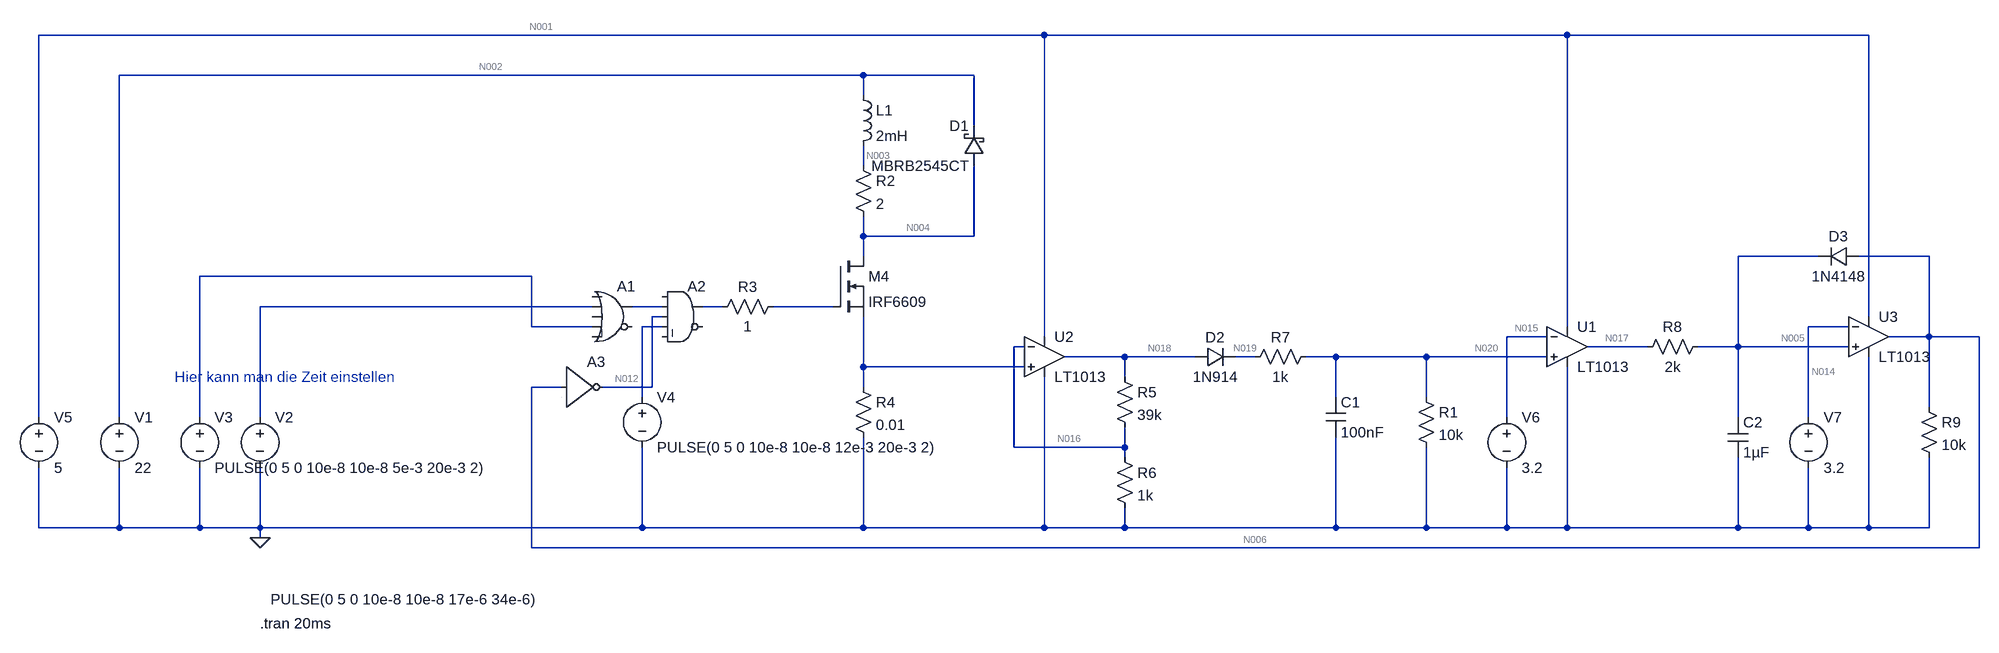
[diagram p0: schematic OpenDrainDriverCurrProtect.asc]
OpenDrainDriverCurrProtect.asc, the LTspice schematic file:
Version 4
SHEET 1 2692 680
WIRE 1200 -464 -400 -464
WIRE 2032 -464 1200 -464
WIRE 2512 -464 2032 -464
WIRE 912 -400 -272 -400
WIRE 1088 -400 912 -400
WIRE 912 -368 912 -400
WIRE 1088 -320 1088 -400
WIRE 912 -256 912 -288
WIRE 912 -144 912 -176
WIRE 1088 -144 1088 -256
WIRE 1088 -144 912 -144
WIRE 912 -112 912 -144
WIRE 2432 -112 2304 -112
WIRE 2608 -112 2496 -112
WIRE 384 -80 -144 -80
WIRE 480 -32 -48 -32
WIRE 592 -32 544 -32
WIRE 688 -32 656 -32
WIRE 864 -32 768 -32
WIRE 592 -16 576 -16
WIRE 2512 -16 2512 -464
WIRE 384 0 384 -80
WIRE 480 0 384 0
WIRE 592 0 560 0
WIRE 2032 0 2032 -464
WIRE 2480 0 2416 0
WIRE 1200 16 1200 -464
WIRE 2000 16 1936 16
WIRE 2608 16 2608 -112
WIRE 2608 16 2544 16
WIRE 2688 16 2608 16
WIRE 1168 32 1152 32
WIRE 2160 32 2064 32
WIRE 2304 32 2304 -112
WIRE 2304 32 2240 32
WIRE 2480 32 2304 32
WIRE 1328 48 1232 48
WIRE 1440 48 1328 48
WIRE 1536 48 1504 48
WIRE 1664 48 1616 48
WIRE 1808 48 1664 48
WIRE 2000 48 1808 48
WIRE 912 64 912 -16
WIRE 1168 64 912 64
WIRE 1328 80 1328 48
WIRE 432 96 384 96
WIRE 576 96 576 -16
WIRE 576 96 496 96
WIRE 912 96 912 64
WIRE 560 112 560 0
WIRE 1664 112 1664 48
WIRE 1808 112 1808 48
WIRE 2608 128 2608 16
WIRE -400 144 -400 -464
WIRE -272 144 -272 -400
WIRE -144 144 -144 -80
WIRE -48 144 -48 -32
WIRE 1936 144 1936 16
WIRE 2304 144 2304 32
WIRE 2416 144 2416 0
WIRE 1152 192 1152 32
WIRE 1328 192 1328 160
WIRE 1328 192 1152 192
WIRE 1328 208 1328 192
WIRE -400 320 -400 224
WIRE -272 320 -272 224
WIRE -272 320 -400 320
WIRE -144 320 -144 224
WIRE -144 320 -272 320
WIRE -48 320 -48 224
WIRE -48 320 -144 320
WIRE 560 320 560 192
WIRE 560 320 -48 320
WIRE 912 320 912 176
WIRE 912 320 560 320
WIRE 1200 320 1200 80
WIRE 1200 320 912 320
WIRE 1328 320 1328 288
WIRE 1328 320 1200 320
WIRE 1664 320 1664 176
WIRE 1664 320 1328 320
WIRE 1808 320 1808 192
WIRE 1808 320 1664 320
WIRE 1936 320 1936 224
WIRE 1936 320 1808 320
WIRE 2032 320 2032 64
WIRE 2032 320 1936 320
WIRE 2304 320 2304 208
WIRE 2304 320 2032 320
WIRE 2416 320 2416 224
WIRE 2416 320 2304 320
WIRE 2512 320 2512 48
WIRE 2512 320 2416 320
WIRE 2608 320 2608 208
WIRE 2608 320 2512 320
WIRE -48 336 -48 320
WIRE 384 352 384 96
WIRE 2688 352 2688 16
WIRE 2688 352 384 352
FLAG -48 336 0
SYMBOL voltage -272 128 R0
WINDOW 123 0 0 Left 0
WINDOW 39 0 0 Left 0
SYMATTR InstName V1
SYMATTR Value 22
SYMBOL voltage -48 128 R0
WINDOW 3 17 306 Left 2
WINDOW 123 0 0 Left 0
WINDOW 39 0 0 Left 0
SYMATTR Value PULSE(0 5 0 10e-8 10e-8 17e-6 34e-6)
SYMATTR InstName V2
SYMBOL res 896 -272 R0
SYMATTR InstName R2
SYMATTR Value 2
SYMBOL ind 896 -384 R0
SYMATTR InstName L1
SYMATTR Value 2mH
SYMBOL voltage -144 128 R0
WINDOW 123 0 0 Left 0
WINDOW 39 0 0 Left 0
SYMATTR InstName V3
SYMATTR Value PULSE(0 5 0 10e-8 10e-8 5e-3 20e-3 2)
SYMBOL nmos 864 -112 R0
SYMATTR InstName M4
SYMATTR Value IRF6609
SYMBOL schottky 1104 -256 R180
WINDOW 0 24 64 Left 2
WINDOW 3 24 0 Left 2
SYMATTR InstName D1
SYMATTR Value MBRB2545CT
SYMATTR Description Diode
SYMATTR Type diode
SYMBOL res 784 -48 R90
WINDOW 0 0 56 VBottom 2
WINDOW 3 32 56 VTop 2
SYMATTR InstName R3
SYMATTR Value 1
SYMBOL res 896 80 R0
SYMATTR InstName R4
SYMATTR Value 0.01
SYMBOL res 1312 64 R0
SYMATTR InstName R5
SYMATTR Value 39k
SYMBOL res 1312 192 R0
SYMATTR InstName R6
SYMATTR Value 1k
SYMBOL diode 1440 64 R270
WINDOW 0 32 32 VTop 2
WINDOW 3 0 32 VBottom 2
SYMATTR InstName D2
SYMATTR Value 1N914
SYMBOL res 1632 32 R90
WINDOW 0 0 56 VBottom 2
WINDOW 3 32 56 VTop 2
SYMATTR InstName R7
SYMATTR Value 1k
SYMBOL cap 1648 112 R0
SYMATTR InstName C1
SYMATTR Value 100nF
SYMBOL OpAmps\\LT1013 1200 -16 R0
SYMATTR InstName U2
SYMBOL Digital\\or 512 -80 R0
SYMATTR InstName A1
SYMATTR SpiceLine Vhigh=5V, Vlow=0V
SYMBOL res 1792 96 R0
SYMATTR InstName R1
SYMATTR Value 10k
SYMBOL Digital\\and 624 -80 R0
SYMATTR InstName A2
SYMATTR SpiceLine Vhigh=5V, Vlow=0V
SYMBOL voltage 560 96 R0
WINDOW 123 0 0 Left 0
WINDOW 39 0 0 Left 0
SYMATTR InstName V4
SYMATTR Value PULSE(0 5 0 10e-8 10e-8 12e-3 20e-3 2)
SYMBOL voltage -400 128 R0
WINDOW 123 0 0 Left 0
WINDOW 39 0 0 Left 0
SYMATTR InstName V5
SYMATTR Value 5
SYMBOL OpAmps\\LT1013 2032 -32 R0
SYMATTR InstName U1
SYMBOL voltage 1936 128 R0
WINDOW 123 0 0 Left 0
WINDOW 39 0 0 Left 0
SYMATTR InstName V6
SYMATTR Value 3.2
SYMBOL res 2256 16 R90
WINDOW 0 0 56 VBottom 2
WINDOW 3 32 56 VTop 2
SYMATTR InstName R8
SYMATTR Value 2k
SYMBOL cap 2288 144 R0
SYMATTR InstName C2
SYMATTR Value 1µF
SYMBOL OpAmps\\LT1013 2512 -48 R0
SYMATTR InstName U3
SYMBOL voltage 2416 128 R0
WINDOW 123 0 0 Left 0
WINDOW 39 0 0 Left 0
SYMATTR InstName V7
SYMATTR Value 3.2
SYMBOL res 2592 112 R0
SYMATTR InstName R9
SYMATTR Value 10k
SYMBOL diode 2496 -128 R90
WINDOW 0 0 32 VBottom 2
WINDOW 3 32 32 VTop 2
SYMATTR InstName D3
SYMATTR Value 1N4148
SYMBOL Digital\\inv 432 32 R0
SYMATTR InstName A3
SYMATTR SpiceLine Vhigh=5V, Vlow=0V
TEXT -48 472 Left 2 !.tran 20ms
TEXT -184 80 Left 2 ;Hier kann man die Zeit einstellen

The netlist it stands for:
* OpenDrainDriverCurrProtect.asc
V1 N002 0 22
V2 N008 0 PULSE(0 5 0 10e-8 10e-8 17e-6 34e-6)
R2 N003 N004 2
L1 N002 N003 2mH
V3 N007 0 PULSE(0 5 0 10e-8 10e-8 5e-3 20e-3 2)
M4 N004 N011 N021 N021 IRF6609
D1 N004 N002 MBRB2545CT
R3 N011 N010 1
R4 N021 0 0.01
R5 N018 N016 39k
R6 N016 0 1k
D2 N018 N019 1N914
R7 N020 N019 1k
C1 N020 0 100nF
XU2 N021 N016 N001 0 N018 LT1013  ; pins In+ In- V+ V- OUT
A1 0 N008 0 N007 0 0 N009 0 OR Vhigh=5V, Vlow=0V
R1 N020 0 10k
A2 0 N009 N012 N013 0 0 N010 0 AND Vhigh=5V, Vlow=0V
V4 N013 0 PULSE(0 5 0 10e-8 10e-8 12e-3 20e-3 2)
V5 N001 0 5
XU1 N020 N015 N001 0 N017 LT1013  ; pins In+ In- V+ V- OUT
V6 N015 0 3.2
R8 N005 N017 2k
C2 N005 0 1µF
XU3 N005 N014 N001 0 N006 LT1013  ; pins In+ In- V+ V- OUT
V7 N014 0 3.2
R9 N006 0 10k
D3 N006 N005 1N4148
A3 N006 0 0 0 0 N012 0 0 BUF Vhigh=5V, Vlow=0V
.model D D
.lib standard.dio
.model NMOS NMOS
.model PMOS PMOS
.lib standard.mos
.tran 20ms
* Hier kann man die Zeit einstellen
.lib LTC.lib
.backanno
.end

* Results of the author's LTspice run, read from the files saved beside the schematic
* Operating Point, zero values left out:
*   V(n002) = 22 V
*   V(n003) = 22 V
*   V(n004) = 22 V
*   V(n018) = 87.69 mV
*   V(n016) = 2.204 mV
*   V(n019) = 358.8 µV
*   V(n020) = 344 µV
*   V(n001) = 5 V
*   V(n012) = 5 V
*   V(n015) = 3.2 V
*   V(n017) = 14.26 mV
*   V(n005) = 14.29 mV
*   V(n014) = 3.2 V
*   V(n006) = 14.15 mV
*   Id(M4) = 113.7 pA
*   Is(M4) = -113.7 pA
*   I(D3) = -7.863 pA
*   I(D2) = 14.79 nA
*   I(L1) = 145.7 pA
*   I(R9) = 1.415 µA
*   I(R8) = 19.56 nA
*   I(R1) = 34.4 nA
*   I(R7) = -14.79 nA
*   I(R6) = 2.204 µA
*   I(R5) = 2.192 µA
*   I(R4) = 12.39 nA
*   I(R2) = 145 pA
*   I(V7) = 4.607 nA
*   I(V6) = 4.575 nA
*   I(V5) = -611.5 µA
*   I(V1) = -144.2 pA
*   Ix(u2:1) = -12.26 nA
*   Ix(u2:2) = -12.25 nA
*   Ix(u2:3) = 348.4 µA
*   Ix(u2:4) = -345.8 µA
*   Ix(u2:5) = -2.207 µA
*   Ix(u1:1) = -19.61 nA
*   Ix(u1:2) = -4.575 nA
*   Ix(u1:3) = 131.3 µA
*   Ix(u1:4) = -121.7 µA
*   Ix(u1:5) = 19.57 nA
*   Ix(u3:1) = -19.57 nA
*   Ix(u3:2) = -4.607 nA
*   Ix(u3:3) = 131.8 µA
*   Ix(u3:4) = -120.8 µA
*   Ix(u3:5) = -1.415 µA